# Altium schematic sheet Slave1_flying_pcb_v1.SchDoc
size A4
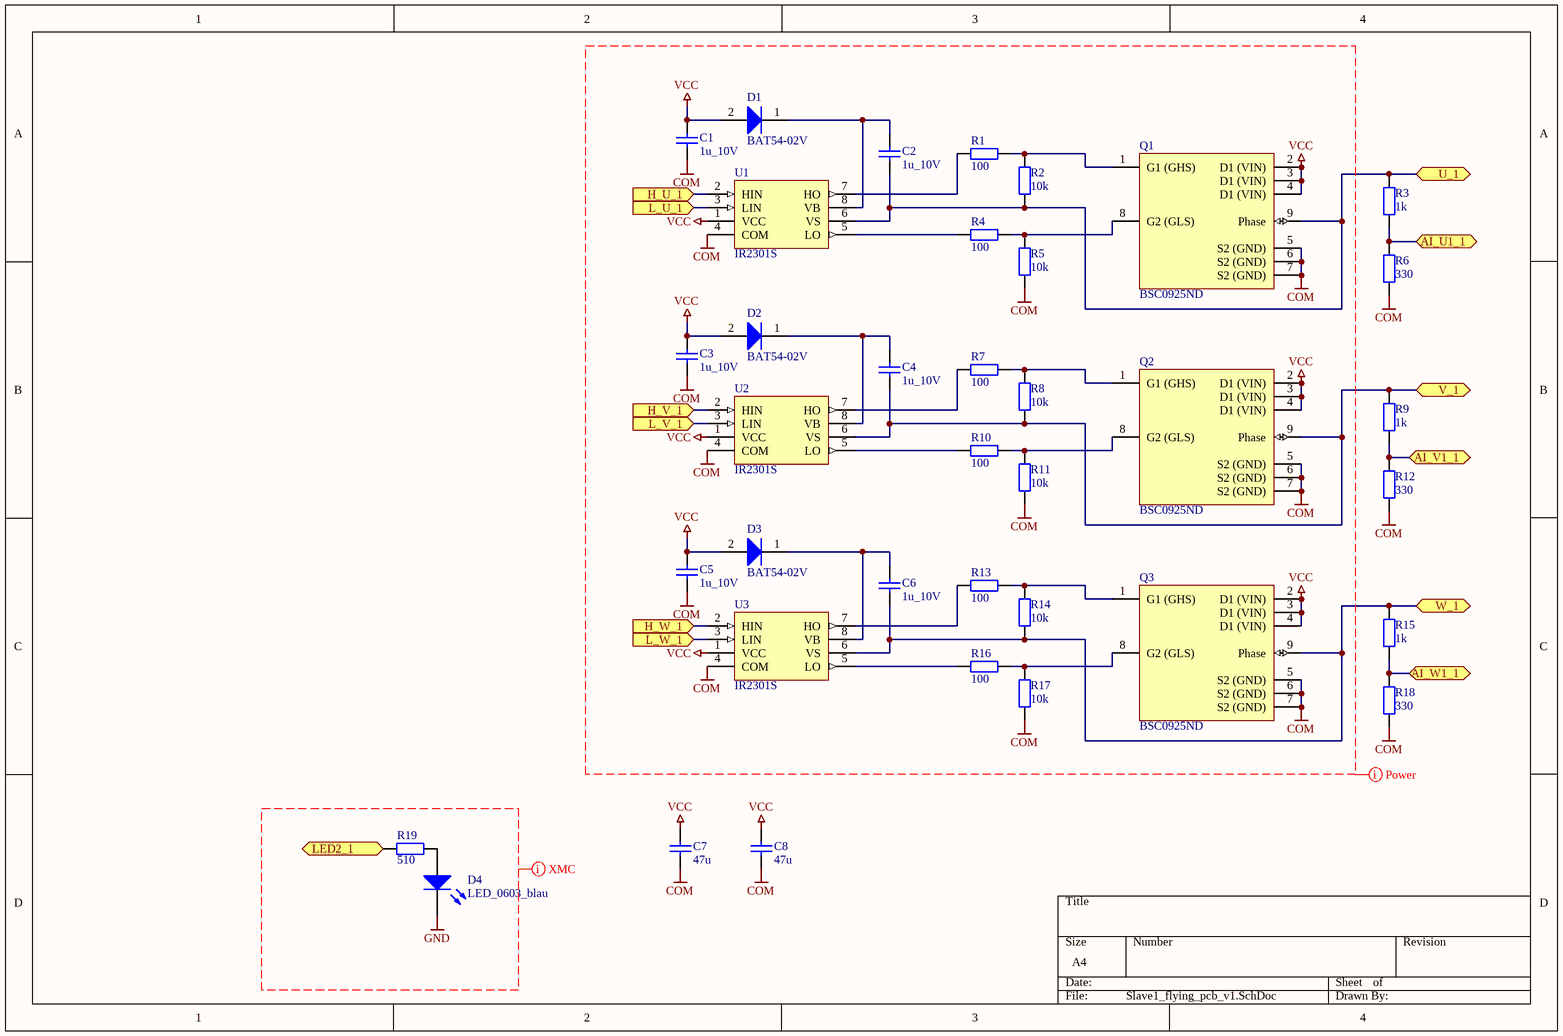
[diagram p0: Slave1_flying_pcb_v1.SchDoc]

## Parts
C1  1u_10V  [1608[0603]]
C2  1u_10V  [1608[0603]]
C3  1u_10V  [1608[0603]]
C4  1u_10V  [1608[0603]]
C5  1u_10V  [1608[0603]]
C6  1u_10V  [1608[0603]]
C7  47u  [_0805]
C8  47u  [_0805]
D1  BAT54-02V  [INF-SC79_V]
D2  BAT54-02V  [INF-SC79_V]
D3  BAT54-02V  [INF-SC79_V]
D4  LED_0603_blau  [LED_0603]
Q1  BSC0925ND  [INF-PG-TISON-8_V]
Q2  BSC0925ND  [INF-PG-TISON-8_V]
Q3  BSC0925ND  [INF-PG-TISON-8_V]
R1  value 100  [1608[0603]]  (hidden comment: Res_0603)
R2  value 10k  [1608[0603]]  (hidden comment: Res_0603)
R3  value 1k  [1608[0603]]  (hidden comment: Res_0603)
R4  value 100  [1608[0603]]  (hidden comment: Res_0603)
R5  value 10k  [1608[0603]]  (hidden comment: Res_0603)
R6  value 330  [1608[0603]]  (hidden comment: Res_0603)
R7  value 100  [1608[0603]]  (hidden comment: Res_0603)
R8  value 10k  [1608[0603]]  (hidden comment: Res_0603)
R9  value 1k  [1608[0603]]  (hidden comment: Res_0603)
R10  value 100  [1608[0603]]  (hidden comment: Res_0603)
R11  value 10k  [1608[0603]]  (hidden comment: Res_0603)
R12  value 330  [1608[0603]]  (hidden comment: Res_0603)
R13  value 100  [1608[0603]]  (hidden comment: Res_0603)
R14  value 10k  [1608[0603]]  (hidden comment: Res_0603)
R15  value 1k  [1608[0603]]  (hidden comment: Res_0603)
R16  value 100  [1608[0603]]  (hidden comment: Res_0603)
R17  value 10k  [1608[0603]]  (hidden comment: Res_0603)
R18  value 330  [1608[0603]]  (hidden comment: Res_0603)
R19  value 510  [1608[0603]]  (hidden comment: Res_0603)
U1  IR2301S  [SO-8_N]
U2  IR2301S  [SO-8_N]
U3  IR2301S  [SO-8_N]

## Ports
AI_U1_1 (bidir), AI_V1_1 (bidir), AI_W1_1 (bidir), H_U_1, H_V_1, H_W_1, L_U_1, L_V_1, L_W_1, LED2_1, U_1 (bidir), V_1 (bidir), W_1 (bidir)

## Nets
COM: C1.2 C3.2 C5.2 C7.1 C8.1 Q1.5(S2_(GND)) Q1.6(S2_(GND)) Q1.7(S2_(GND)) Q2.5(S2_(GND)) Q2.6(S2_(GND)) Q2.7(S2_(GND)) Q3.5(S2_(GND)) Q3.6(S2_(GND)) Q3.7(S2_(GND)) R5.2 R6.2 R11.2 R12.2 R17.2 R18.2 U1.4(COM) U2.4(COM) U3.4(COM)
GND: D4.2
VCC: C1.1 C3.1 C5.1 C7.2 C8.2 D1.2(A) D2.2(A) D3.2(A) Q1.2(D1_(VIN)) Q1.3(D1_(VIN)) Q1.4(D1_(VIN)) Q2.2(D1_(VIN)) Q2.3(D1_(VIN)) Q2.4(D1_(VIN)) Q3.2(D1_(VIN)) Q3.3(D1_(VIN)) Q3.4(D1_(VIN)) U1.1(VCC) U2.1(VCC) U3.1(VCC)
AI_U1_1: R3.2 R6.1 ; port AI_U1_1
AI_V1_1: R9.2 R12.1 ; port AI_V1_1
AI_W1_1: R15.2 R18.1 ; port AI_W1_1
H_U_1: U1.2(HIN) ; port H_U_1
H_V_1: U2.2(HIN) ; port H_V_1
H_W_1: U3.2(HIN) ; port H_W_1
L_U_1: U1.3(LIN) ; port L_U_1
L_V_1: U2.3(LIN) ; port L_V_1
L_W_1: U3.3(LIN) ; port L_W_1
LED2_1: R19.1 ; port LED2_1
U_1: C2.2 Q1.9(Phase) R2.2 R3.1 U1.6(VS) ; port U_1
V_1: C4.2 Q2.9(Phase) R8.2 R9.1 U2.6(VS) ; port V_1
W_1: C6.2 Q3.9(Phase) R14.2 R15.1 U3.6(VS) ; port W_1
NetC2_1: C2.1 D1.1(K) U1.8(VB)
NetC4_1: C4.1 D2.1(K) U2.8(VB)
NetC6_1: C6.1 D3.1(K) U3.8(VB)
NetD4_1: D4.1 R19.2
NetQ1_1: Q1.1(G1_(GHS)) R1.1 R2.1
NetQ1_8: Q1.8(G2_(GLS)) R4.1 R5.1
NetQ2_1: Q2.1(G1_(GHS)) R7.1 R8.1
NetQ2_8: Q2.8(G2_(GLS)) R10.1 R11.1
NetQ3_1: Q3.1(G1_(GHS)) R13.1 R14.1
NetQ3_8: Q3.8(G2_(GLS)) R16.1 R17.1
NetR1_2: R1.2 U1.7(HO)
NetR4_2: R4.2 U1.5(LO)
NetR7_2: R7.2 U2.7(HO)
NetR10_2: R10.2 U2.5(LO)
NetR13_2: R13.2 U3.7(HO)
NetR16_2: R16.2 U3.5(LO)

## Layout directives
net class Power: COM, VCC
net class XMC: GND

## Library data of the parts
C1-C6 = Cap_133: RS_number: 788-2884; QR: 0; Capacity: 1u; Voltage: 10V; UID: Cap_133; Name: 1u_10V; Name_Hyperlink: http://at.rs-online.com/web/p/keramik-multilayer-kondensatoren/7882884; ComponentLink1URL: #NAME?; mounting: SMD
C7 C8 = Cap_133: Name: Cap_cer_1u_50V; Capacity: 1u; Voltage: 50V; RS_number: 723-6350; QR: 0; UID: Cap_133; ComponentLink1URL: #NAME?; mounting: SMD; Name_Hyperlink: http://at.rs-online.com/web/p/keramik-multilayer-kondensatoren/7236350/
D1-D3 = BAT54-02V: Silicon Schottky Diode, SC79, Reel, Green; Manufacturer: Infineon; Green: TRUE; PackageReference: SC79; PackageDescription: 2-Pin Semiconductor Package, 0.8 x 1.2 mm Body; Supplier 1: Mouser; Supplier Part Number 1: N/A; Halogen-free: FALSE; Mounting Technology: Surface Mount; PartNumber: BAT54-02V; ComponentLink1Description: Manufacturer URL; ComponentLink1URL: http://www.infineon.com/; ComponentLink2Description: Datasheet; ComponentLink2URL: http://www.infineon.com/dgdl/bat54series.pdf?folderId=db3a30431400ef68011425f1ca2505e3&fileId=db3a304314dca3890115190b74210ea6; ComponentLink3Description: Package Specification; ComponentLink3URL: http://www.infineon.com/dgdl/SC79-Package_Overview.pdf?folderId=db3a30431936bc4b011951fbddb03b15&fileId=db3a30431936bc4b01195226fe583b41
D4 = DIODE_60: Type: LED; Colour: blau; RS_number: 697-3610P; QR: 0; UID: DIODE_60; Name: LED_0603_blau; Name_Hyperlink: http://at.rs-online.com/web/p/products/6973610P/; ComponentLink1URL: #WERT!; mounting: SMD
Q1-Q3 = BSC0925ND: N-Channel OptiMOS Power-MOSFET, 30 V VDS, 40 A ID, -55 to 150 degC, PG-TISON-8, Reel, Green; Manufacturer: Infineon; Green: TRUE; ID (max): 40 A; IDpuls (max): 160 A; Polarity: N; Ptot (max): 30 W; QG: 6.7 nC; RDS (on) (max): 5 mOhm; RDS (on) (max) (@4.5V): 7 mOhm; Rth: 4.2 K/W; RthJA (max): 125 K/W; VDS (max): 30 V; VGS(th) (max): 2 V; VGS(th) (min): 1.2 V; DatasheetVersion: Rev. 1.0; PackageVersion: Rev. 01, 09/2011; PackageReference: PG-TISON-8; PackageDescription: 8-Pin Plastic (Green) Small Outline Non-Leaded Package, 5 x 6 mm Body, 1.27 mm Pitch; Halogen-free: TRUE; Packing: Reel; RthJC (max): 4.2 K/W; Mounting Technology: Surface Mount; PartNumber: BSC0925ND; ComponentLink1Description: Manufacturer URL; ComponentLink1URL: http://www.infineon.com/; ComponentLink2Description: Datasheet; ComponentLink2URL: http://www.infineon.com/dgdl/BSC0925ND_rev1+0.pdf?folderId=db3a304313b8b5a60113cee8763b02d7&fileId=db3a304336ca04c90136cec562a24914; ComponentLink3Description: Package Specification; ComponentLink3URL: http://www.infineon.com/dgdl/BSC0910NDI_Rev. 0.5.pdf?folderId=db3a304313b8b5a60113cee8763b02d7&fileId=db3a304336ca04c90136cedc08b64926
R1-R19 = Res_6: UID: Res_6; Name: Res_0603; ComponentLink1URL: #NAME?; mounting: SMD
U1-U3 = IR2101S: High and Low Side Driver; Published: 8-Jun-2000; LatestRevisionDate: 13-Apr-2006; LatestRevisionNote: IPC-7351 Footprint Added.; DatasheetVersion: PD60043J; PackageVersion: Feb-2001; PackageReference: SO-8; Publisher: Altium Limited; PackageDescription: 8-Pin Plastic Small Outline Integrated Circuit 1.27 mm Pitch; Code_JEDEC: MS-012-AA; Code_IPC: SOIC127P600-8; ComponentLink1Description: Manufacturer Link; ComponentLink1URL: http://www.irf.com/